# EAGLE schematic afron_line_sensor (EAGLE 6.1)
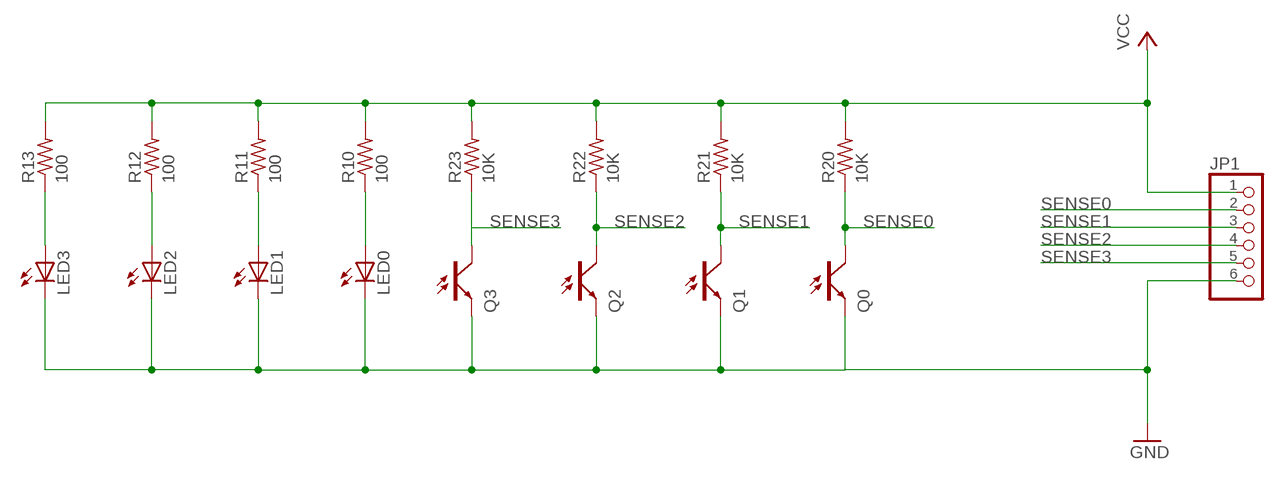
[diagram p0: schematic, sheet 1]

## Parts
JP1  PINHD-1X06_2.54  [1X06]
LED0  LED3MM  [LED3MM]
LED1  LED3MM  [LED3MM]
LED2  LED3MM  [LED3MM]
LED3  LED3MM  [LED3MM]
Q0  PHOTOTRANSISTOR3MM  [LED3MM]
Q1  PHOTOTRANSISTOR3MM  [LED3MM]
Q2  PHOTOTRANSISTOR3MM  [LED3MM]
Q3  PHOTOTRANSISTOR3MM  [LED3MM]
R10  100  R-US_0204/5  [0204/5]
R11  100  R-US_0204/5  [0204/5]
R12  100  R-US_0204/5  [0204/5]
R13  100  R-US_0204/5  [0204/5]
R20  10K  R-US_0204/5  [0204/5]
R21  10K  R-US_0204/5  [0204/5]
R22  10K  R-US_0204/5  [0204/5]
R23  10K  R-US_0204/5  [0204/5]

## Nets
GND: JP1.6 LED0.K(C) LED1.K(C) LED2.K(C) LED3.K(C) Q0.K(C) Q1.K(C) Q2.K(C) Q3.K(C)
N$1: LED0.A R10.1
N$2: LED2.A R12.1
N$3: LED3.A R13.1
N$7: LED1.A R11.1
SENSE0: JP1.2 Q0.A R20.1
SENSE1: JP1.3 Q1.A R21.1
SENSE2: JP1.4 Q2.A R22.1
SENSE3: JP1.5 Q3.A R23.1
VCC: JP1.1 R10.2 R11.2 R12.2 R13.2 R20.2 R21.2 R22.2 R23.2

## Library data of the parts
JP1 = pinhead-2:PINHD-1X06: PIN HEADER
LED0 LED1-LED3 = led:LED: LED OSRAM: - CHIPLED LG R971, LG N971, LY N971, LG Q971, LY Q971, LO R971, LY R971 LH N974, LH R974 LS Q976, LO Q976, LY Q976 LO Q996 - Hyper CHIPLED LW Q18S LB Q993, LB Q99A, LB R99A - SideLED LS A670, LO A670, LY A670, LG A670, LP A670 LB A673, LV A673, LT A673, LW A673 LH A674 LY A675 LS A676, LA A676, LO A676, LY A676, LW A676 LS A679, LY A679, LG A679 - Hyper Micro SIDELED® LS Y876, LA Y876, LO Y876, LY Y876 LT Y87S - SmartLED LW L88C, LW L88S LB L89C, LB L89S, LG L890 LS L89K, LO L89K, LY L89K LS L896, LA L896, LO L896, LY L896 - TOPLED LS T670, LO T670, LY T670, LG T670, LP T670 LSG T670, LSP T670, LSY T670, LOP T670, LYG T670 LG T671, LOG T671, LSG T671 LB T673, LV T673, LT T673, LW T673 LH T674 LS T676, LA T676, LO T676, LY T676, LB T676, LH T676, LSB T676, LW T676 LB T67C, LV T67C, LT T67C, LS T67K, LO T67K, LY T67K, LW E67C LS E67B, LA E67B, LO E67B, LY E67B, LB E67C, LV E67C, LT E67C LW T67C LS T679, LY T679, LG T679 LS T770, LO T770, LY T770, LG T770, LP T770 LB T773, LV T773, LT T773, LW T773 LH T774 LS E675, LA E675, LY E675, LS T675 LS T776, LA T776, LO T776, LY T776, LB T776 LHGB T686 LT T68C, LB T68C - Hyper Mini TOPLED® LB M676 - Mini TOPLED Santana® LG M470 LS M47K, LO M47K, LY M47K Source: http://www.osram.convergy.de LUXEON: - LUMILED® LXK2-PW12-R00, LXK2-PW12-S00, LXK2-PW14-U00, LXK2-PW14-V00 LXK2-PM12-R00, LXK2-PM12-S00, LXK2-PM14-U00 LXK2-PE12-Q00, LXK2-PE12-R00, LXK2-PE12-S00, LXK2-PE14-T00, LXK2-PE14-U00 LXK2-PB12-K00, LXK2-PB12-L00, LXK2-PB12-M00, LXK2-PB14-N00, LXK2-PB14-P00, LXK2-PB14-Q00 LXK2-PR12-L00, LXK2-PR12-M00, LXK2-PR14-Q00, LXK2-PR14-R00 LXK2-PD12-Q00, LXK2-PD12-R00, LXK2-PD12-S00 LXK2-PH12-R00, LXK2-PH12-S00 LXK2-PL12-P00, LXK2-PL12-Q00, LXK2-PL12-R00 Source: www.luxeon.com KINGBRIGHT: KA-3528ASYC Source: www.kingbright.com
Q0 Q1-Q3 = mes_opto:PHOTOTRANSISTOR: Phototransistor
R10-R13 R20-R23 = resistor:R-US_: RESISTOR, American symbol